# Altium schematic sheet Sheet_f446.schdoc
size 309 x 211 mm
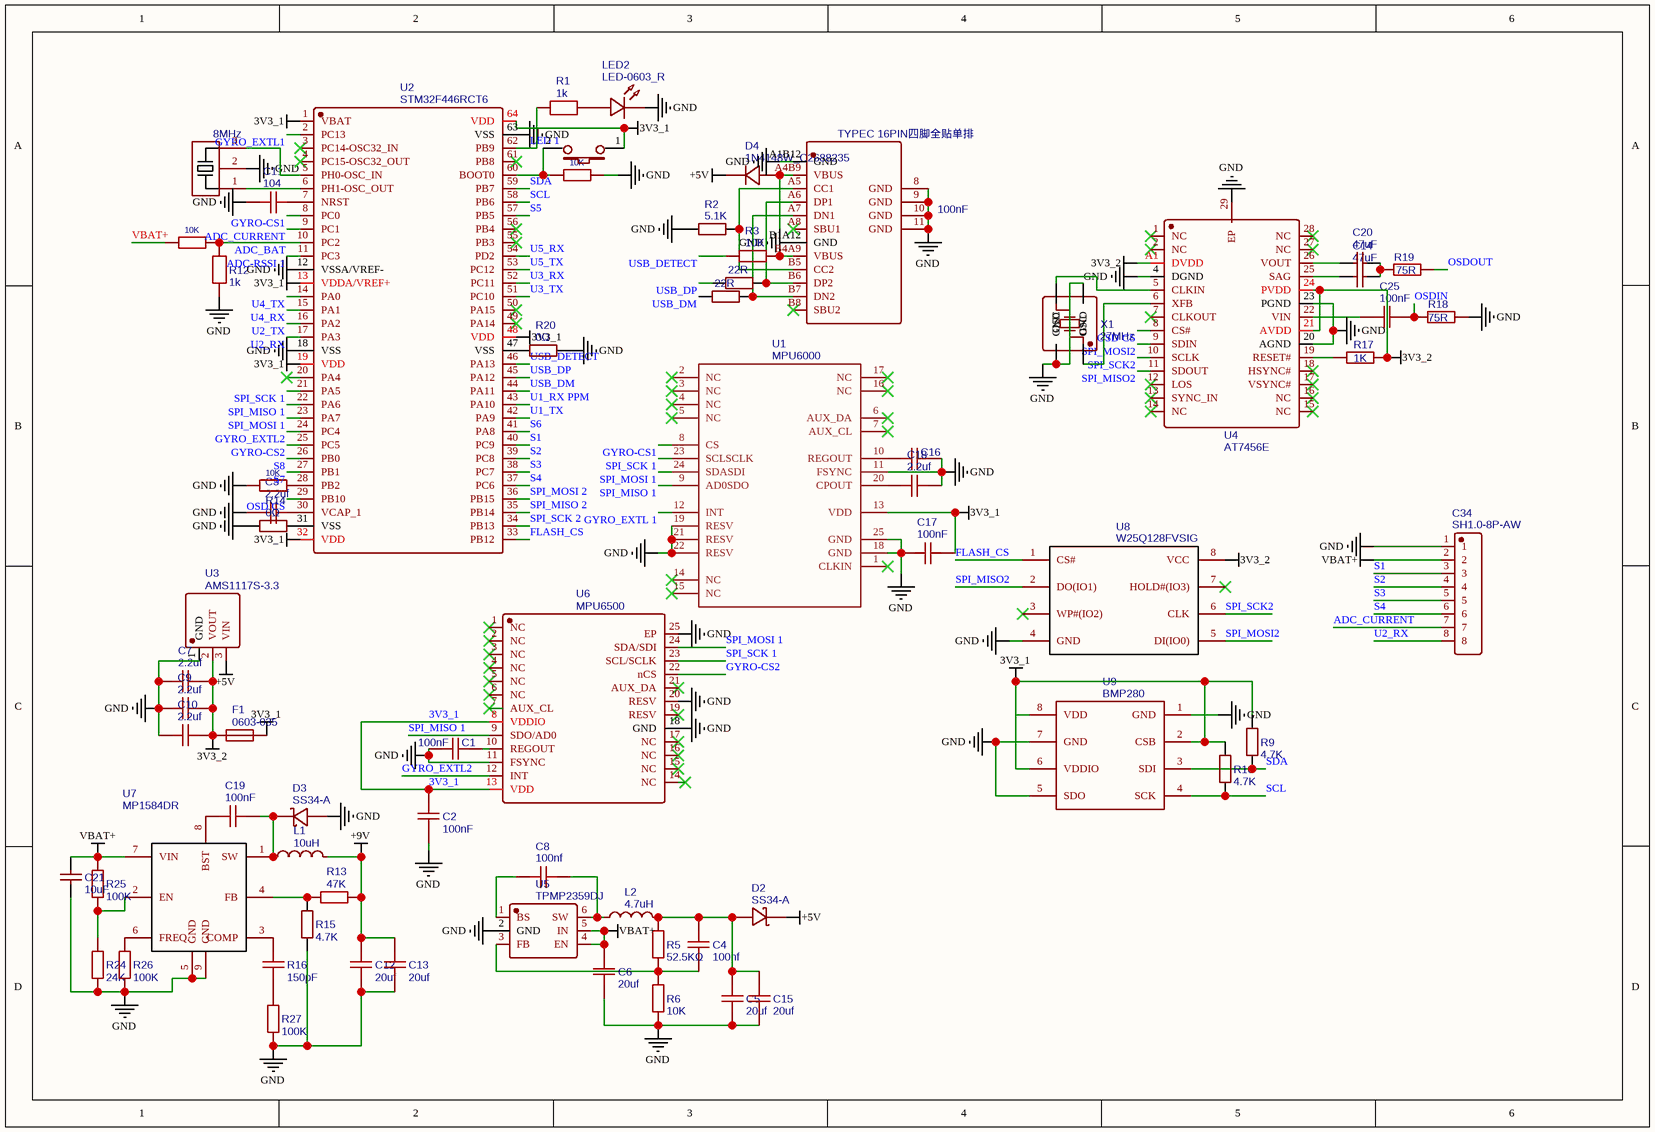
[diagram p0: Sheet_f446.schdoc]

## Parts
BOOT1  两脚小龟 3*4*2  [SW-SMD_L4.0-W2.9-LS5.0]  (value not drawn)
C1  100nF  [R0402]
C2  100nF  [R0402]
C3  2.2uf  [R0402]
C4  100nf  [R0402]
C5  20uf  [C0603]
C6  20uf  [C0603]
C7  2.2uf  [R0402]
C8  100nf  [C0603]
C9  2.2uf  [R0402]
C10  2.2uf  [R0402]
C11  104  [R0402]
C12  20uf  [C0603]
C13  20uf  [C0603]
C14  47uF  [C0805]
C15  20uf  [C0603]
C16  100nF  [R0402]
C17  100nF  [R0402]
C18  2.2uf  [R0402]
C19  100nF  [C0603]
C20  47uF  [C0805]
C21  10uF  [C1206]
C25  100nF  [R0402]
C34  SH1.0-8P-AW  [SH1.0-8P-AW]
D2  SS34-A  [SMA_L4.3-W2.6-LS5.2-RD]
D3  SS34-A  [SMA_L4.3-W2.6-LS5.2-RD]
D4  1N4148W_C2688235  [SOD-123_L2.7-W1.6-LS3.8-RD]
F1  0603-035  [F0603]
L1  10uH  [IND-SMD_L5.2-W5.2_MCW-0530]
L2  4.7uH  [IND-SMD_L4.3-W4.0_GPSR0420]
LED2  LED-0603_R  [LED0603_RED]
NO  TYPEC 16PIN四脚全贴单排  [USB-C-SMD_TYPEC-16PIN]
R1  1k  [R0402]
R2  5.1K  [R0402]
R3  10K  [R0402]
R4  10K  [R0402]
R5  52.5KΩ  [R0402]
R6  10K  [R0402]
R8  10K  [R0402]
R9  4.7K  [R0402]
R10  4.7K  [R0402]
R11  10K  [R0402]
R12  1k  [R0402]
R13  47K  [R0402]
R14  0Ω  [R0402]
R15  4.7K  [R0402]
R16  150pF  [R0402]
R17  1K  [R0402]
R18  75R  [R0402]
R19  75R  [R0402]
R20  0Ω  [R0402]
R21  22R  [R0402]
R22  22R  [R0402]
R24  24K  [R0402]
R25  100K  [R0402]
R26  100K  [R0402]
R27  100K  [R0402]
U1  MPU6000  [MPU6000]
U2  STM32F446RCT6  [STM32F446]
U3  AMS1117S-3.3  [SOT-89-3_L4.5-W2.5-P1.50-LS4.1-BR]
U4  AT7456E  [HTSSOP-28_L9.7-W4.4-P0.65-LS6.4-BL-EP-2]
U5  TPMP2359DJ  [SOT-23-6_L2.9-W1.6-P0.95-LS2.8-BL]
U6  MPU6500  [MPU6500]
U7  MP1584DR  [SOIC-8_L4.9-W3.9-P1.27-LS6.0-BL-EP3.4]
U8  W25Q128FVSIG  [SOIC-8_L5.3-W5.3-P1.27-LS8.0-BL]
U9  BMP280  [LGA-8]
X1  27MHz  [CRYSTAL-SMD_4P-L2.0-W1.6-BL]
X3  8MHz  [X3213]

## Nets
3V3_1: BOOT1.1 C2.2 C17.2 F1.2 R9.2 R10.2 U1.13(VDD) U2.1(VBAT) U2.13(VDDA/VREF+) U2.19(VDD) U2.32(VDD) U2.48(VDD) U2.64(VDD) U6.8(VDDIO) U6.13(VDD) U9.2(CSB) U9.6(VDDIO) U9.8(VDD)
3V3_2: C7.2 C9.1 C10.1 F1.1 R17.2 U3.2(VOUT) U4.21(AVDD) U4.24(PVDD) U4.A1(DVDD) U8.8(VCC)
+5V: D2.1(C) D4.1(K) U3.3(VIN)
+9V: C12.2 C13.2 L1.2 R13.2
GND: C1.1 C2.1 C3.2 C5.2 C6.1 C7.1 C9.2 C10.2 C11.2 C12.1 C13.1 C15.1 C16.2 C17.1 C18.2 C21.1 C34.1 D3.2(A) LED2.2 NO.8(GND) NO.9(GND) NO.10(GND) NO.11(GND) NO.A1B12(GND) NO.B1A12(GND) R2.1 R4.1 R6.1 R8.1 R12.1 R14.1 R15.1 R18.2 R20.2 R24.1 R26.1 R27.1 U1.11(FSYNC) U1.18(GND) U1.19(RESV) U1.21(RESV) U1.22(RESV) U1.25(GND) U2.12(VSSA/VREF-) U2.18(VSS) U2.63(VSS) U3.1(GND) U4.4(DGND) U4.20(AGND) U4.23(PGND) U4.29(EP) U5.2(GND) U6.11(FSYNC) U6.18(GND) U6.20(RESV) U6.25(EP) U7.5(GND) U7.9(GND) U8.4(GND) U9.1(GND) U9.5(SDO) U9.7(GND) X1.2(GND) X1.4(GND) X3.2
VBAT+: C6.2 C21.2 C34.2 R11.2 R25.2 U5.4(EN) U5.5(IN) U7.7(VIN)
ADC-RSSI 1: U2.11(PC3)
ADC_BAT: R11.1 R12.2 U2.10(PC2)
ADC_CURRENT: C34.7 U2.9(PC1)
FLASH_CS: U2.33(PB12) U8.1(CS#)
GYRO-CS1: U1.8(CS) U2.8(PC0)
GYRO-CS2: U2.25(PC5) U6.22(nCS)
GYRO_EXTL1: U2.2(PC13)
GYRO_EXTL2: U2.24(PC4) U6.12(INT)
GYRO_EXTL 1: U1.12(INT)
LED 1: R1.1 U2.62(PB9)
OSD CS: U2.29(PB10) U4.8(CS#)
OSDIN: C25.1 R18.1
OSDOUT: R19.2
S1: C34.3 U2.40(PC9)
S2: C34.4 U2.39(PC8)
S3: C34.5 U2.38(PC7)
S4: C34.6 U2.37(PC6)
S5: U2.57(PB5)
S6: U2.41(PA8)
S7: U2.27(PB1)
S8: U2.26(PB0)
SCL: R10.1 U2.58(PB6) U9.4(SCK)
SDA: R9.1 U2.59(PB7) U9.3(SDI)
SPI_MISO2: U4.11(SDOUT) U8.2(DO(IO1))
SPI_MISO 1: U1.9(AD0SDO) U2.22(PA6) U6.9(SDO/AD0)
SPI_MISO 2: U2.35(PB14)
SPI_MOSI2: U4.9(SDIN) U8.5(DI(IO0))
SPI_MOSI 1: U1.24(SDASDI) U2.23(PA7) U6.24(SDA/SDI)
SPI_MOSI 2: U2.36(PB15)
SPI_SCK2: U4.10(SCLK) U8.6(CLK)
SPI_SCK 1: U1.23(SCLSCLK) U2.21(PA5) U6.23(SCL/SCLK)
SPI_SCK 2: U2.34(PB13)
U1_RX PPM: U2.43(PA10)
U1_TX: U2.42(PA9)
U2_RX: C34.8 U2.17(PA3)
U2_TX: U2.16(PA2)
U3_RX: U2.52(PC11)
U3_TX: U2.51(PC10)
U4_RX: U2.15(PA1)
U4_TX: U2.14(PA0)
U5_RX: U2.54(PD2)
U5_TX: U2.53(PC12)
USB_DETECT: R3.1 U2.46(PA13)
USB_DM: R22.2 U2.44(PA11)
USB_DP: R21.2 U2.45(PA12)
NetBOOT1_2: BOOT1.2 R4.2 U2.60(BOOT0)
NetC1_2: C1.2 U6.10(REGOUT)
NetC3_1: C3.1 U2.30(VCAP_1)
NetC4_1: C4.1 C5.1 C15.2 D2.2(A) L2.2 R5.2
NetC4_2: C4.2 R5.1 R6.2 U5.3(FB)
NetC8_1: C8.1 L2.1 U5.6(SW)
NetC8_2: C8.2 U5.1(BS)
NetC11_1: C11.1 U2.7(NRST)
NetC14_1: C14.1 U4.25(SAG)
NetC14_2: C14.2 C20.2 R19.1
NetC16_1: C16.1 U1.10(REGOUT)
NetC18_1: C18.1 U1.20(CPOUT)
NetC19_1: C19.1 U7.8(BST)
NetC19_2: C19.2 D3.1(C) L1.1 U7.1(SW)
NetC20_1: C20.1 U4.26(VOUT)
NetC25_2: C25.2 U4.22(VIN)
NetD4_2: D4.2(A) NO.A4B9(VBUS) NO.B4A9(VBUS) R3.2
NetLED2_1: LED2.1 R1.2
NetNO_A5: NO.A5(CC1) NO.B5(CC2) R2.2
NetNO_A6: NO.A6(DP1) NO.B6(DP2) R21.1
NetNO_A7: NO.A7(DN1) NO.B7(DN2) R22.1
NetR8_2: R8.2 U2.28(PB2)
NetR13_1: R13.1 R15.2 U7.4(FB)
NetR14_2: R14.2 U2.31(VSS)
NetR16_1: R16.1 R27.2
NetR16_2: R16.2 U7.3(COMP)
NetR17_1: R17.1 U4.19(RESET#)
NetR20_1: R20.1 U2.47(VSS)
NetR24_2: R24.2 R25.1 U7.2(EN)
NetR26_2: R26.2 U7.6(FREQ.)
NetU2_5: U2.5(PH0-OSC_IN) X3.3
NetU2_6: U2.6(PH1-OSC_OUT) X3.1
NetU4_5: U4.5(CLKIN) X1.3(OSC)
NetU4_6: U4.6(XFB) X1.1(OSC)

Not connected (* = marked no-connect by the designer): NO A8(SBU1)* B8(SBU2)*; U1 1(CLKIN)* 2(NC)* 3(NC)* 4(NC)* 5(NC)* 6(AUX_DA)* 7(AUX_CL)* 14(NC)* 15(NC)* 16(NC)* 17(NC)*; U2 3(PC14-OSC32_IN)* 4(PC15-OSC32_OUT)* 20(PA4)* 49(PA14)* 50(PA15)* 55(PB3)* 56(PB4)* 61(PB8)*; U4 1(NC)* 2(NC)* 7(CLKOUT)* 12(LOS)* 13(SYNC_IN)* 14(NC)* 15(NC)* 16(NC)* 17(VSYNC#)* 18(HSYNC#)* 27(NC)* 28(NC)*; U6 1(NC)* 2(NC)* 3(NC)* 4(NC)* 5(NC)* 6(NC)* 7(AUX_CL)* 14(NC)* 15(NC)* 16(NC)* 17(NC)* 19(RESV)* 21(AUX_DA)*; U8 3(WP#(IO2))* 7(HOLD#(IO3))*

## Library data of the parts
BOOT1 = 两脚小龟 3*4*2: BOM_Manufacturer: null; Contributor: LCSC; BOM_Supplier: LCSC; BOM_Supplier Part: C2837315; BOM_Manufacturer Part: 两脚小龟 3*4*2; BOM_JLCPCB Part Class: Extended Part; spicePre: U; spiceSymbolName: 两脚小龟 3*4*2
C1 C2 C16 C17 = 100nF: BOM_Manufacturer: MuRata; BOM_Manufacturer Part: GRM155F50J104ZA01D; nameAlias: Capacitance; BOM_Supplier: LCSC; BOM_Supplier Part: C85956; spicePre: C; spiceSymbolName: GRM155F50J104ZA01D
C3 C7 C9 C10 C18 = 2.2uf: nameAlias: Value(F); Contributor: LCEDA_Lib; spicePre: C; spiceSymbolName: C_0603_US
C4 C8 = 100nf: BOM_Manufacturer: YAGEO; BOM_Manufacturer Part: CC0603FRNPO9BN201; nameAlias: Capacitance; Contributor: LCSC; BOM_Supplier: LCSC; BOM_JLCPCB Part Class: Extended Part; spicePre: C; spiceSymbolName: CC0603FRNPO9BN201
C5 C6 C12 C13 C15 = 20uf: BOM_Manufacturer: YAGEO; BOM_Manufacturer Part: CC0603FRNPO9BN201; nameAlias: Capacitance; Contributor: LCSC; BOM_Supplier: LCSC; BOM_JLCPCB Part Class: Extended Part; spicePre: C; spiceSymbolName: CC0603FRNPO9BN201
C11 = 104: nameAlias: Value(F); Contributor: LCEDA_Lib; spicePre: C; spiceSymbolName: C_0603_US
C14 C20 = 47uF: BOM_Manufacturer Part: CL21A476MQYNNNE; BOM_Manufacturer: SAMSUNG(三星); nameAlias: Capacitance; BOM_Supplier: LCSC; BOM_Supplier Part: C16780; BOM_JLCPCB Part Class: Basic Part; spicePre: C; spiceSymbolName: CL21A476MQYNNNE
C19 = 100nF: BOM_Manufacturer: YAGEO; BOM_Manufacturer Part: CC0603KRX7R9BB104; nameAlias: Capacitance; BOM_Supplier: LCSC; BOM_Supplier Part: C14663; BOM_JLCPCB Part Class: Basic Part; spicePre: C; spiceSymbolName: CC0603KRX7R9BB104
C21 = 10uF: BOM_Manufacturer: FH; BOM_Manufacturer Part: 1206F106M500NT; nameAlias: Capacitance; BOM_Supplier: LCSC; BOM_Supplier Part: C110256; BOM_JLCPCB Part Class: Extended Part; spicePre: C; spiceSymbolName: 1206F106M500NT
C25 = 100nF: BOM_Manufacturer: WTC; BOM_Manufacturer Part: 0402B104K500; nameAlias: Capacitance; Contributor: LCSC; BOM_Supplier: LCSC; BOM_Supplier Part: C152814; spicePre: C; spiceSymbolName: 0402B104K500; BOM_JLCPCB Part Class: Extended Part
C34 = SH1.0-8P-AW: Contributor: xiogua; spicePre: C; spiceSymbolName: SH1.0-8P-AW
D2 D3 = SS34-A: BOM_Manufacturer: Formosa Microsemi; Contributor: LCSC; BOM_Supplier: LCSC; BOM_Supplier Part: C143201; BOM_Manufacturer Part: SS34-A; BOM_JLCPCB Part Class: Extended Part; spicePre: D; spiceSymbolName: SS34-A
D4 = 1N4148W_C2688235: BOM_Manufacturer: WPMtek(维攀微); Contributor: LCSC; BOM_Supplier: LCSC; BOM_Supplier Part: C2688235; BOM_Manufacturer Part: 1N4148W; BOM_JLCPCB Part Class: Extended Part; spicePre: D; spiceSymbolName: 1N4148W_C2688235
F1 = 0603-035: BOM_Manufacturer: TECHFUSE; BOM_Supplier: LCSC; BOM_Manufacturer Part: 0603-035; BOM_Supplier Part: C70051; BOM_JLCPCB Part Class: Extended Part; spicePre: F; spiceSymbolName: 0603-035
L1 = 10uH: BOM_Manufacturer: Hk-hotline; BOM_Manufacturer Part: MCW-0530-100-N1; nameAlias: Inductance; Contributor: LCSC; BOM_Supplier: LCSC; BOM_Supplier Part: C169352; BOM_JLCPCB Part Class: Extended Part; spicePre: L; spiceSymbolName: MCW-0530-100-N1
L2 = 4.7uH: BOM_Manufacturer: Gantong(感通); BOM_Manufacturer Part: GPSR0420-4R7MS01; Contributor: LCSC; nameAlias: Inductance; BOM_Supplier: LCSC; BOM_Supplier Part: C477143; BOM_JLCPCB Part Class: Extended Part; spicePre: L; spiceSymbolName: GPSR0420-4R7MS01
LED2 = LED-0603_R: BOM_Manufacturer: EVERLIGHT(台湾亿光); BOM_Manufacturer Part: 19-217/R6C-AL1M2VY/3T; Contributor: LCEDA_01; BOM_Supplier Part: C72044; BOM_Supplier: LCSC; spicePre: L; spiceSymbolName: LED-0603_R
NO = TYPEC 16PIN四脚全贴单排: Contributor: LCSC; BOM_Supplier: LCSC; BOM_Supplier Part: C9900003589; BOM_Manufacturer Part: TYPEC 16PIN四脚全贴单排; link: https://img.jlc.com/pdf/applyPasteComponent/2021-12-08/781117D/1d5a0f94a59343aa80cf3de8e7c27d91/TYPE-C-16PIN%E5%9B%9B%E8%84%9A%E5%85%A8%E8%B4%B4%E5%8D%95-%E6%8E%92%E6%9D%BF%E4%B8%8A%E5%9E%8B-%E9%87%91; BOM_JLCPCB Part Class: Extended Part; spicePre: U; spiceSymbolName: TYPEC 16PIN四脚全贴单排
R1 R12 = 1k: nameAlias: Value(Ω); Contributor: LCEDA_Lib; spicePre: R; spiceSymbolName: R_0402_EU
R2 = 5.1K: BOM_Manufacturer: YAGEO; BOM_Manufacturer Part: RC0402DR-075K1L; nameAlias: Resistance (Ohms); Resistance: 5.1kΩ; BOM_Supplier: LCSC; BOM_Supplier Part: C138073; BOM_JLCPCB Part Class: Extended Part; spicePre: R; spiceSymbolName: RC0402DR-075K1L
R3 = 10K: BOM_Manufacturer: YAGEO; BOM_Manufacturer Part: AC0402FR-0710KL; nameAlias: Resistance (Ohms); Contributor: LCSC; Resistance: 10kΩ; BOM_Supplier: LCSC; BOM_Supplier Part: C144807; BOM_JLCPCB Part Class: Extended Part; spicePre: R; spiceSymbolName: AC0402FR-0710KL
R4 R8 R11 = 10K: BOM_Manufacturer: Uniroyal Elec; BOM_Manufacturer Part: TC0225B1002TCE; nameAlias: Resistance (Ohms); Contributor: LCSC; SMT Type: Extend; BOM_Supplier: LCSC; BOM_Supplier Part: C84351; BOM_LCSC Assembly: Yes; spicePre: R; spiceSymbolName: TC0225B1002TCE; BOM_JLCPCB Part Class: Extended Part
R5 = 52.5KΩ: BOM_Manufacturer: Uniroyal Elec; BOM_Manufacturer Part: 0402WGF523JTCE; Resistance (Ohms): 52.3; nameAlias: Resistance; Contributor: LCSC; BOM_Supplier: LCSC; BOM_Supplier Part: C114978; BOM_JLCPCB Part Class: Extended Part; spicePre: R; spiceSymbolName: 0402WGF523JTCE
R6 = 10K: BOM_Manufacturer: YAGEO; BOM_Manufacturer Part: AC0402JR-0710KL; nameAlias: Resistance (Ohms); Contributor: LCSC; Resistance: 10kΩ; BOM_Supplier: LCSC; BOM_Supplier Part: C144731; BOM_JLCPCB Part Class: Extended Part; spicePre: R; spiceSymbolName: AC0402JR-0710KL
R9 R10 R15 = 4.7K: BOM_Manufacturer: YAGEO; BOM_Manufacturer Part: RC0402FR-074K7L; nameAlias: Resistance (Ohms); Resistance: 4.7kΩ; BOM_Supplier: LCSC; BOM_Supplier Part: C105871; BOM_JLCPCB Part Class: Extended Part; spicePre: R; spiceSymbolName: RC0402FR-074K7L
R13 = 47K: BOM_Manufacturer: YAGEO; BOM_Manufacturer Part: AC0402JR-0747KL; nameAlias: Resistance (Ohms); Contributor: LCSC; Resistance: 47kΩ; BOM_Supplier: LCSC; BOM_Supplier Part: C144710; BOM_JLCPCB Part Class: Extended Part; spicePre: R; spiceSymbolName: AC0402JR-0747KL
R14 R20 = 0Ω: nameAlias: Resistance; Contributor: 微客; Resistance (Ohms): 0Ω; spicePre: R; spiceSymbolName: 0Ω
R16 = 150pF: BOM_Manufacturer: KEMET(基美); BOM_Manufacturer Part: C0402C151J8JAC7867; Contributor: LCSC; nameAlias: Capacitance; BOM_Supplier: LCSC; BOM_Supplier Part: C1623917; BOM_JLCPCB Part Class: Extended Part; spicePre: R; spiceSymbolName: C0402C151J8JAC7867
R17 = 1K: BOM_Manufacturer: Viking Tech; BOM_Manufacturer Part: CR-02JL6----1K; nameAlias: Resistance (Ohms); Contributor: LCSC; BOM_Supplier: LCSC; BOM_Supplier Part: C279987; spicePre: R; spiceSymbolName: CR-02JL6----1K
R18 R19 = 75R: BOM_Manufacturer: Hong Kong Resistors; BOM_Manufacturer Part: RCT0275RJLF; nameAlias: Resistance (Ohms); Contributor: LCSC; BOM_Supplier: LCSC; BOM_Supplier Part: C174263; spicePre: R; spiceSymbolName: RCT0275RJLF; BOM_JLCPCB Part Class: Extended Part
R21 R22 = 22R: BOM_Manufacturer: TA-I; BOM_Manufacturer Part: RM04FTN22R0; nameAlias: Resistance (Ohms); BOM_Supplier: LCSC; BOM_Supplier Part: C153098; spicePre: R; spiceSymbolName: RM04FTN22R0
R24 = 24K: BOM_Manufacturer: YAGEO; BOM_Manufacturer Part: AC0402JR-0724KL; nameAlias: Resistance (Ohms); Contributor: LCSC; Resistance: 24kΩ; BOM_Supplier: LCSC; BOM_Supplier Part: C227339; BOM_JLCPCB Part Class: Extended Part; spicePre: R; spiceSymbolName: AC0402JR-0724KL
R25-R27 = 100K: BOM_Manufacturer: YAGEO(国巨); BOM_Manufacturer Part: AC0402JR-07100KL; nameAlias: Resistance (Ohms); Contributor: LCSC; Resistance: 100kΩ; BOM_Supplier: LCSC; BOM_Supplier Part: C144732; BOM_JLCPCB Part Class: Extended Part; spicePre: R; spiceSymbolName: AC0402JR-07100KL
U1 = MPU6000: Contributor: msnrooon; spicePre: U; spiceSymbolName: MPU6000
U2 = STM32F446RCT6: BOM_Manufacturer: ST(意法半导体); Contributor: LCSC; BOM_Supplier: LCSC; BOM_Supplier Part: C915971; BOM_Manufacturer Part: STM32F446RCT6; BOM_JLCPCB Part Class: Extended Part; spicePre: U; spiceSymbolName: STM32F446RCT6
U3 = AMS1117S-3.3: BOM_Manufacturer: JSMSEMI; Contributor: LCSC; BOM_Supplier: LCSC; BOM_Supplier Part: C917152; BOM_Manufacturer Part: AMS1117S-3.3; BOM_JLCPCB Part Class: Extended Part; spicePre: U; spiceSymbolName: AMS1117S-3.3
U4 = AT7456E: BOM_Manufacturer: ZHONGKEWEI; BOM_Supplier: LCSC; BOM_Manufacturer Part: AT7456E; BOM_Supplier Part: C82351; BOM_JLCPCB Part Class: Extended Part; spicePre: U; spiceSymbolName: AT7456E
U5 = TPMP2359DJ: BOM_Manufacturer: TECH PUBLIC(台舟); Contributor: LCSC; BOM_Supplier: LCSC; BOM_Supplier Part: C2959845; BOM_Manufacturer Part: TPMP2359DJ; BOM_JLCPCB Part Class: Extended Part; spicePre: U; spiceSymbolName: TPMP2359DJ
U6 = MPU6500: BOM_Manufacturer: InvenSense; Package Display: No; BOM_Supplier: LCSC; BOM_Manufacturer Part: MPU6500; BOM_Supplier Part: C50278; spicePre: U; spiceSymbolName: MPU6500; BOM_JLCPCB Part Class: Extended Part
U7 = MP1584DR: Contributor: chejia12; spicePre: U; spiceSymbolName: MP1584DR
U8 = W25Q128FVSIG: BOM_Manufacturer: WINBOND; BOM_Supplier: LCSC; BOM_Manufacturer Part: W25Q128FVSIG; BOM_Supplier Part: C35101; spicePre: U; spiceSymbolName: W25Q128FVSIG
U9 = BMP280: BOM_Manufacturer: Bosch; BOM_Supplier: LCSC; BOM_Manufacturer Part: BMP280; BOM_Supplier Part: C83291; spicePre: U
X1 = 27MHz: BOM_Manufacturer: Nihon Dempa Kogyo; BOM_Manufacturer Part: NX2016SA-STD-CZS-5-27MHZ; nameAlias: Frequency; Contributor: LCSC; BOM_Supplier: LCSC; BOM_Supplier Part: C438902; BOM_JLCPCB Part Class: Extended Part; spicePre: X; spiceSymbolName: NX2016SA-STD-CZS-5-27MHZ
X3 = 8MHz: BOM_Manufacturer: MuRata; BOM_Manufacturer Part: CSTCE8M00G55A-R0; nameAlias: Frequency; BOM_Supplier: LCSC; BOM_Supplier Part: C91587; spicePre: X; spiceSymbolName: CSTCE8M00G55A-R0